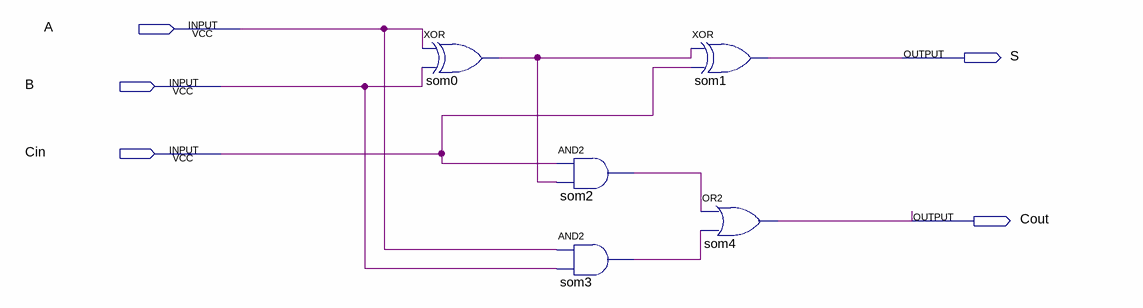
[diagram p0: schematic sheet]
// Quartus schematic somador2.bdf as structural Verilog: 5 symbols, 5 pins
module somador2 (
  input  A,
  input  B,
  input  Cin,
  output S,
  output Cout
);

  wire som0_out, som2_out, som3_out;

  xor som0 (som0_out, A, B);
  and som2 (som2_out, Cin, som0_out);
  and som3 (som3_out, A, B);
  xor som1 (S, som0_out, Cin);
  or som4 (Cout, som2_out, som3_out);
endmodule
